# EAGLE design Lichtsteuerung-ESP8266 (EAGLE 6.6.0)
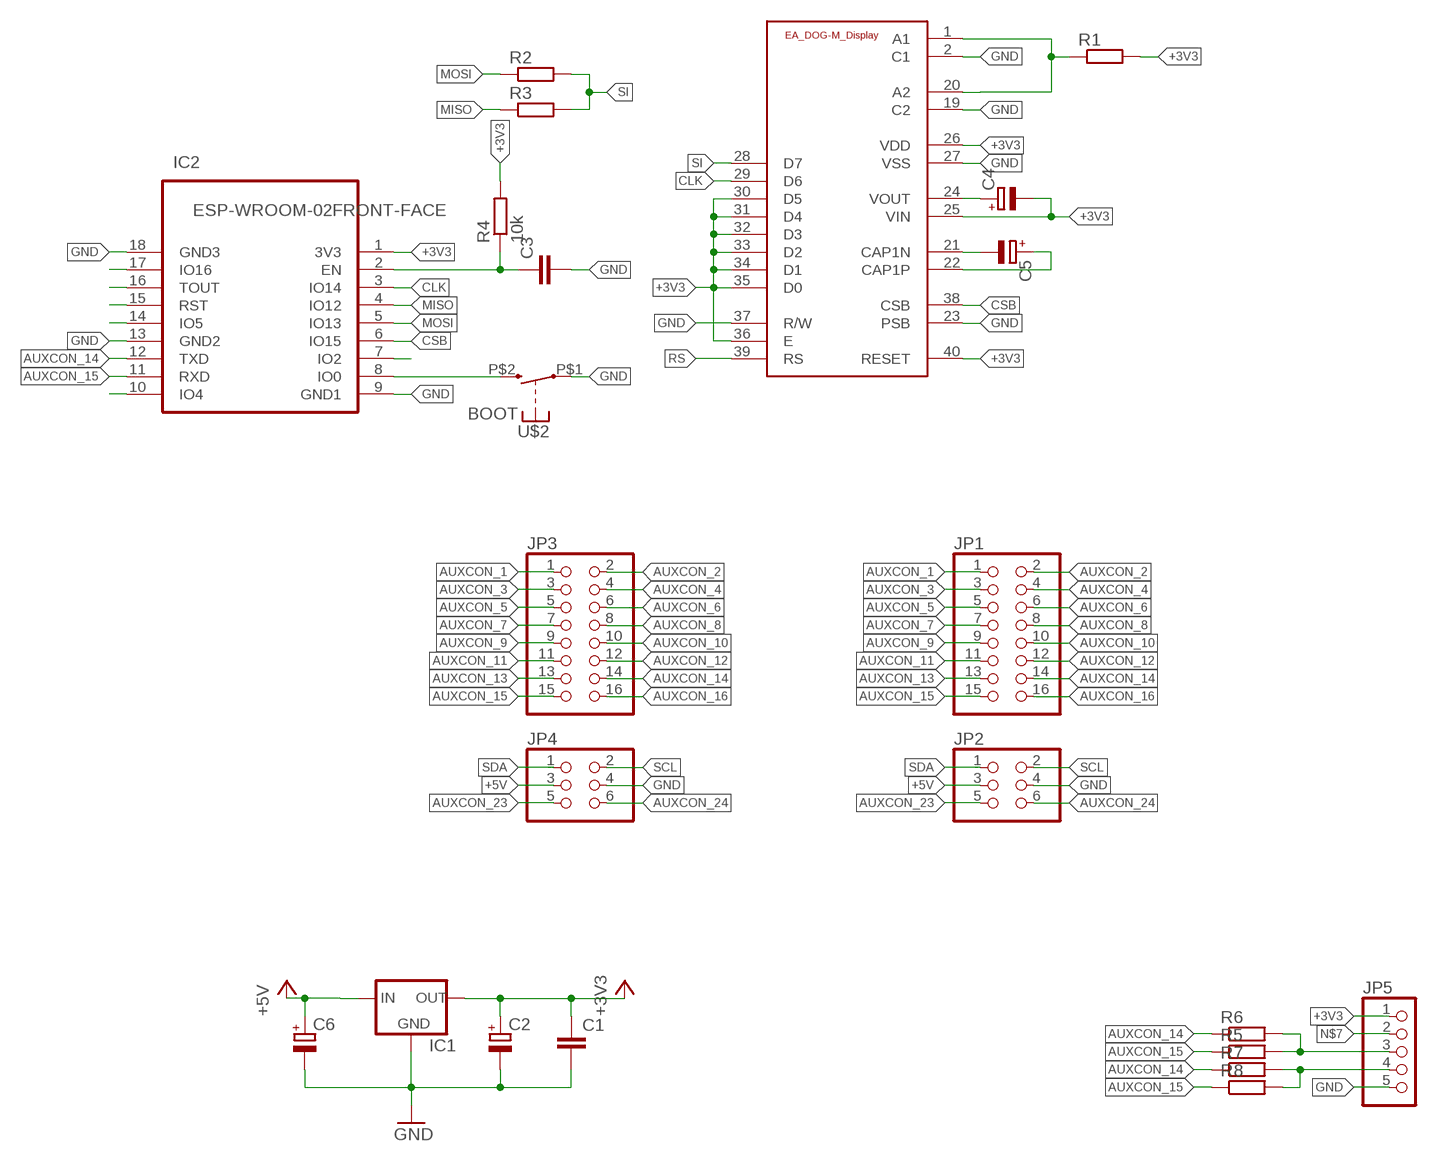
[diagram p0: schematic, sheet 1]

## Parts
C1  C-EUC1206  [C1206]
C2  CPOL-EUC/6032-28R  [C/6032-28R]
C3  C-EUC1206  [C1206]
C4  CPOL-EUSMCA  [SMC_A]
C5  CPOL-EUSMCA  [SMC_A]
C6  CPOL-EUC/6032-28R  [C/6032-28R]
IC1  LM1117  [SOT223]
IC2  ESP-WROOM-02FRONT-FACE  [FRONT-FACE]
JP1  PINHD-2X8  [2X08]
JP2  PINHD-2X3  [2X03]
JP3  PINHD-2X8  [2X08]
JP4  PINHD-2X3  [2X03]
JP5  PINHD-1X5  [1X05]
R1  R-EU_R1206  [R1206]
R2  R-EU_R1206  [R1206]
R3  R-EU_R1206  [R1206]
R4  10k  R-EU_R1206  [R1206]
R5  R-EU_R1206  [R1206]
R6  R-EU_R1206  [R1206]
R7  R-EU_R1206  [R1206]
R8  R-EU_R1206  [R1206]
U$1  EA_DOG-M_DISPLAY  [E_DOG-M_DISPLAY]
U$2  BOOT  ALPSSKPM  [SKPM]

## Nets
+3V3: C1.1 C2.+ C4.- IC1.2(OUT) IC2.1(3V3) JP5.1 R1.2 R4.2 U$1.25(VIN) U$1.26(VDD) U$1.30(D5) U$1.31(D4) U$1.32(D3) U$1.33(D2) U$1.34(D1) U$1.35(D0) U$1.36(E) U$1.40(RESET)
+5V: C6.+ IC1.3(IN) JP2.3 JP4.3
AUXCON_1: JP1.1 JP3.1
AUXCON_2: JP1.2 JP3.2
AUXCON_3: JP1.3 JP3.3
AUXCON_4: JP1.4 JP3.4
AUXCON_5: JP1.5 JP3.5
AUXCON_6: JP1.6 JP3.6
AUXCON_7: JP1.7 JP3.7
AUXCON_8: JP1.8 JP3.8
AUXCON_9: JP1.9 JP3.9
AUXCON_10: JP1.10 JP3.10
AUXCON_11: JP1.11 JP3.11
AUXCON_12: JP1.12 JP3.12
AUXCON_13: JP1.13 JP3.13
AUXCON_14: IC2.12(TXD) JP1.14 JP3.14 R6.1 R7.1
AUXCON_15: IC2.11(RXD) JP1.15 JP3.15 R5.1 R8.1
AUXCON_16: JP1.16 JP3.16
AUXCON_23: JP2.5 JP4.5
AUXCON_24: JP2.6 JP4.6
CLK: IC2.3(IO14) U$1.29(D6)
CSB: IC2.6(IO15) U$1.38(CSB)
GND: C1.2 C2.- C3.2 C6.- IC1.1(GND) IC2.9(GND1) IC2.13(GND2) IC2.18(GND3) JP2.4 JP4.4 JP5.5 U$1.2(C1) U$1.19(C2) U$1.23(PSB) U$1.27(VSS) U$1.37(R/W) U$2.P$1(P)
MISO: IC2.4(IO12) R3.1
MOSI: IC2.5(IO13) R2.1
N$2: C4.+ U$1.24(VOUT)
N$3: R1.1 U$1.1(A1) U$1.20(A2)
N$4: C5.- U$1.21(CAP1N)
N$5: C3.1 IC2.2(EN) R4.1
N$7: JP5.2
N$10: IC2.7(IO2)
N$11: IC2.8(IO0) U$2.P$2(S)
N$12: IC2.10(IO4)
N$13: C5.+ U$1.22(CAP1P)
N$15: IC2.14(IO5)
N$16: IC2.15(RST)
N$17: IC2.16(TOUT)
N$18: IC2.17(IO16)
N$111: JP5.3 R5.2 R6.2
N$222: JP5.4 R7.2 R8.2
RS: U$1.39(RS)
SCL: JP2.2 JP4.2
SDA: JP2.1 JP4.1
SI: R2.2 R3.2 U$1.28(D7)

## Library data of the parts
C1 C3 = rcl:C-EU: CAPACITOR, European symbol
C2 C4-C6 = rcl:CPOL-EU: POLARIZED CAPACITOR, European symbol
IC1 = v-reg-2:LM1117
IC2 = esp-wroom-02:ESP-WROOM-02: WiFi module - ESP-WROOM-02
JP1 JP3 = pinhead:PINHD-2X8: PIN HEADER; OC_REICHELT: MPE 087-2-016
JP2 JP4 = pinhead:PINHD-2X3: PIN HEADER; OC_REICHELT: MPE 087-2-006
JP5 = pinhead:PINHD-1X5: PIN HEADER
R1 = resistor:R-EU_: RESISTOR, European symbol
R2-R8 = rcl:R-EU_: RESISTOR, European symbol
U$1 = display_ea_dog-m:EA_DOG-M_DISPLAY
U$2 = ALPS SKPM:ALPSSKPM

## Board
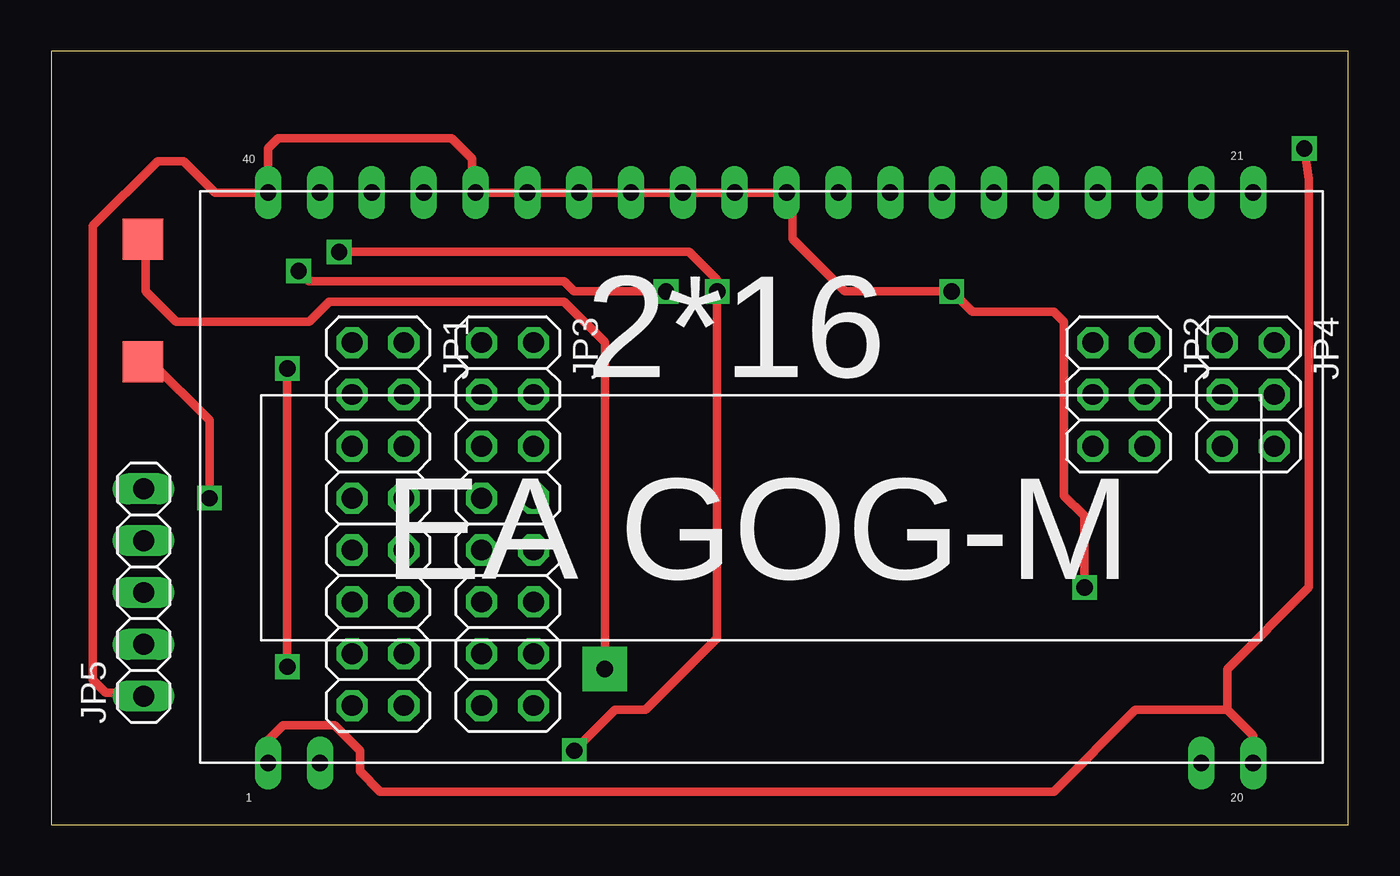
[diagram p1: board, top side]
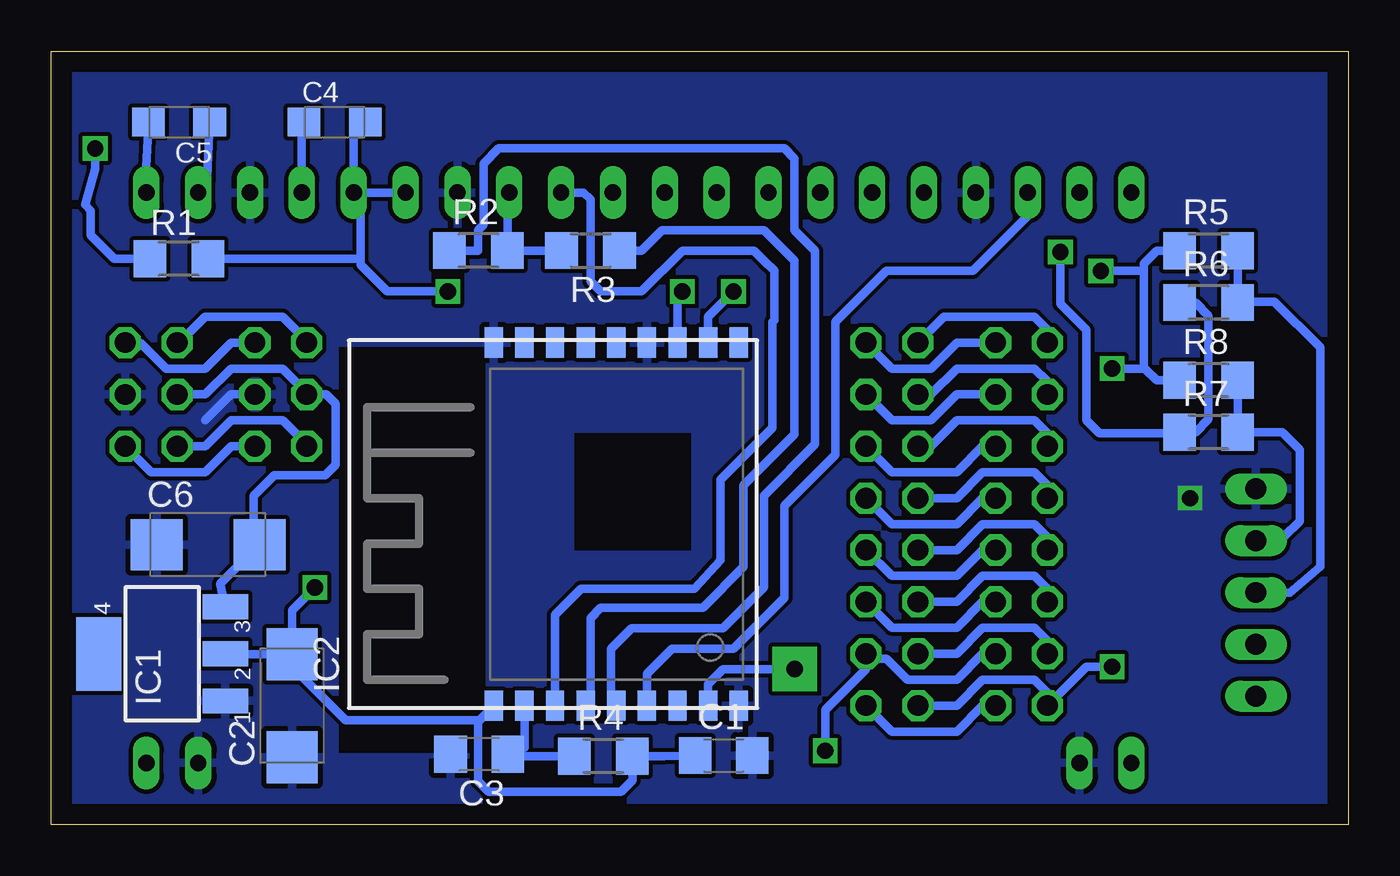
[diagram p2: board, bottom side, seen from below]

Size 63.57 x 37.91 mm. Coordinates in mm from the lower left corner, seen from the top.
Outline: 0,0 63.57,0 63.57,37.91 0,37.91 0,0
Copper layers (1*16): Top 0.035mm / dielectric 1.5mm / Bottom 0.035mm
Design rules "default": minimum track width 10mil, minimum drill 24mil, track to track 8mil, track to pad 8mil, pad to pad 8mil, via to via 8mil, smd to smd 8mil, copper to edge 40mil, drill to drill 8mil, minimum pad ring 10mil, minimum via ring 8mil, stop-mask expansion 4mil, vias tented up to drill 0mil, thermal gap 10mil

### Footprints (pad centres in the part's own frame; a part is rotated, then mirrored left to right if it is on the bottom)
C1206 = smd 1.6 x 1.8: 1 -1.4,0; 2 1.4,0
C/6032-28R = smd 2.55 x 2.5: + 2.525,0; - -2.525,0
SMC_A = smd 1.6 x 1.4: + -1.5,0; - 1.5,0
SOT223 = smd 1.219 x 2.235: 1 -2.311,-3.099; 2 0,-3.099; 3 2.311,-3.099 | smd 3.6 x 2.2: 4 0,3.099
FRONT-FACE = smd 1.485 x 0.9: 1 -8.893,4.9; 2 -8.893,3.4; 3 -8.893,1.9; 4 -8.893,0.4; 5 -8.893,-1.1; 6 -8.893,-2.6; 7 -8.893,-4.1; 8 -8.893,-5.6; 9 -8.893,-7.1; 10 8.893,-7.1; 11 8.893,-5.6; 12 8.893,-4.1; 13 8.893,-2.6; 14 8.893,-1.1; 15 8.893,0.4; 16 8.893,1.9; 17 8.893,3.4; 18 8.893,4.9
2X08 = drill 1.016 octagon: 1 -8.89,-1.27; 2 -8.89,1.27; 3 -6.35,-1.27; 4 -6.35,1.27; 5 -3.81,-1.27; 6 -3.81,1.27; 7 -1.27,-1.27; 8 -1.27,1.27; 9 1.27,-1.27; 10 1.27,1.27; 11 3.81,-1.27; 12 3.81,1.27; 13 6.35,-1.27; 14 6.35,1.27; 15 8.89,-1.27; 16 8.89,1.27
2X03 = drill 1.016 octagon: 1 -2.54,-1.27; 2 -2.54,1.27; 3 0,-1.27; 4 0,1.27; 5 2.54,-1.27; 6 2.54,1.27
1X05 = drill 1.016 long: 1 -5.08,0; 2 -2.54,0; 3 0,0; 4 2.54,0; 5 5.08,0
R1206 = smd 1.6 x 1.803: 1 -1.422,0; 2 1.422,0
E_DOG-M_DISPLAY = drill 0.8 long: 1 3.334,0; 2 5.874,0; 19 49.054,0; 20 51.594,0; 21 51.594,27.94; 22 49.054,27.94; 23 46.514,27.94; 24 43.974,27.94; 25 41.434,27.94; 26 38.894,27.94; 27 36.354,27.94; 28 33.814,27.94; 29 31.274,27.94; 30 28.734,27.94; 31 26.194,27.94; 32 23.654,27.94; 33 21.114,27.94; 34 18.574,27.94; 35 16.034,27.94; 36 13.494,27.94; 37 10.954,27.94; 38 8.414,27.94; 39 5.874,27.94; 40 3.334,27.94
SKPM = smd 2 x 2: P$1 -3,0; P$2 3,0

### Placement (x,y rotation side)
C1  30.61,3.4 0 bottom
C2  51.76,5.85 90 bottom
C3  42.59,3.46 180 bottom
C4  49.68,34.42 0 bottom
C5  57.3,34.42 180 bottom
C6  55.88,13.74 0 bottom
IC1  58.12,8.39 90 bottom
IC2  36.98,14.74 90 bottom
JP1  16.02,14.74 270 top
JP2  52.31,21.09 270 top
JP3  22.37,14.74 270 top
JP4  58.66,21.09 270 top
JP5  4.54,11.39 90 top
R1  57.31,27.74 0 bottom
R2  42.64,28.14 0 bottom
R3  37.14,28.14 180 bottom
R4  36.51,3.37 0 bottom
R5  6.86,28.13 0 bottom
R6  6.86,25.59 0 bottom
R7  6.86,19.24 0 bottom
R8  6.86,21.78 0 bottom
U$1  7.31,3.04 0 top
U$2  4.51,25.68 90 top

### Tracks (layer width: path | path; a pad name or v marks a point on that pad's centre or on a via)
+3V3  (via drill 0.8 pad 1.02)
  Top 0.406: v50.64,11.64 50.64,15.14 49.64,16.14 49.64,24.64 49.14,25.14 45.14,25.14 v44.14,26.14 38.91,26.14 36.34,28.71 36.34,30.67 U$1.30 U$1.31 U$1.32 U$1.33 U$1.34 U$1.35 U$1.36 20.64,31.14 20.64,32.64 19.64,33.64 11.14,33.64 10.64,33.14 U$1.40 8.04,30.98 6.5,32.52 5.23,32.52 2.05,29.34 2.05,7.12 2.69,6.48 4.36,6.48 JP5.1
  Bottom 0.406: U$1.26 U$1.25 | 42.07,5.65 IC2.1 42.58,5.14 | C2.+ 54.76,8.37 IC1.2 | R4.2 33.54,3.37 C1.1 | 35.14,2.82 R4.2 | C2.+ 51.76,7.76 49.14,5.14 42.58,5.14 | R4.2 35.09,2.18 35.64,1.64 42.14,1.64 42.64,2.14 42.64,5.08 42.58,5.14 | C2.+ 51.76,10.52 v50.64,11.64 | v44.14,26.14 46.53,26.14 47.11,26.14 48.41,27.43 48.41,27.64 | U$1.25 48.74,33.86 C4.- | 48.41,27.64 48.41,30.64 U$1.25 | R1.2 48.51,27.74 48.41,27.64
+5V
  Bottom 0.406: JP4.3 56.03,21.09 54.76,22.36 52.22,22.36 51.04,21.18 JP2.3 50.09,21.09 49.64,20.64 49.64,17.64 50.14,17.14 52.64,17.14 53.64,16.14 53.64,14.02 C6.+ 55.28,11.81 IC1.3
AUXCON_1
  Bottom 0.406: JP1.1 14.75,24.26 15.39,24.89 19.83,24.89 JP3.1
AUXCON_2
  Bottom 0.406: JP1.2 19.2,23.63 20.46,22.36 22.37,22.36 JP3.2
AUXCON_3
  Bottom 0.406: JP1.3 14.75,21.72 15.39,22.36 19.2,22.36 20.46,21.09 JP3.3
AUXCON_4
  Bottom 0.406: JP1.4 19.2,21.09 20.46,19.82 22.37,19.82 JP3.4
AUXCON_5
  Bottom 0.406: JP1.5 14.75,19.18 15.39,19.82 19.2,19.82 20.46,18.54 JP3.5
AUXCON_6
  Bottom 0.406: JP1.6 17.93,18.54 19.2,17.28 22.37,17.28 JP3.6
AUXCON_7
  Bottom 0.406: JP1.7 14.75,16.64 15.39,17.28 17.93,17.28 19.2,16 JP3.7
AUXCON_8
  Bottom 0.406: JP1.8 17.93,16 19.2,14.74 22.37,14.74 JP3.8
AUXCON_9
  Bottom 0.406: JP1.9 14.75,14.1 15.39,14.74 17.93,14.74 19.2,13.46 JP3.9
AUXCON_10
  Bottom 0.406: JP1.10 17.93,13.46 19.2,12.2 22.37,12.2 JP3.10
AUXCON_11
  Bottom 0.406: JP1.11 14.75,11.56 15.39,12.2 17.93,12.2 19.2,10.93 JP3.11
AUXCON_12
  Bottom 0.406: JP1.12 17.93,10.93 19.2,9.66 22.37,9.66 JP3.12
AUXCON_13
  Bottom 0.406: JP1.13 14.75,9.02 15.39,9.66 17.93,9.66 19.2,8.39 JP3.13
AUXCON_14  (via drill 0.8 pad 1.02)
  Top 0.406: v25.64,3.64 27.64,5.64 29.14,5.64 32.64,9.14 v32.64,26.14 32.64,26.7 31.26,28.07 v14.12,28.07
  Bottom 0.406: JP1.14 17.93,8.39 19.2,7.12 21.61,7.12 22.64,8.14 23.39,8.14 JP3.14 23.64,7.64 25.64,5.64 v25.64,3.64 | R6.1 7.49,25.59 6.86,24.95 6.86,19.87 7.49,19.24 R7.1 8.33,19.18 12.21,19.18 12.85,19.82 12.85,24.26 14.12,25.53 v14.12,28.07 | IC2.12 32.88,25.89 v32.64,26.14
AUXCON_15  (via drill 0.8 pad 1.02)
  Top 0.406: v30.14,26.14 25.64,26.14 25.14,26.64 12.64,26.64 v12.14,27.14 | v11.58,7.75 v11.58,22.36
  Bottom 0.406: JP1.15 14.75,6.48 15.39,7.12 17.93,7.12 19.2,5.85 JP3.15 21.35,5.85 | R8.1 9.4,21.78 9.95,22.32 10.03,22.41 | 10.03,22.41 10.03,25.15 10.03,27.14 | 10.03,27.14 10.03,27.49 9.4,28.13 R5.1 | JP1.15 14.43,5.85 | IC2.11 31.38,24.89 v30.14,26.14 | v12.14,27.14 10.03,27.14 | JP1.15 12.85,7.75 v11.58,7.75 | v11.58,22.36 10.09,22.36 10.03,22.41
AUXCON_16
  Bottom 0.406: JP1.16 17.93,5.85 19.2,4.58 22.37,4.58 JP3.16
AUXCON_23
  Bottom 0.406: JP2.5 51.04,18.64 52.22,19.82 54.76,19.82 56.03,18.54 JP4.5
AUXCON_24
  Bottom 0.406: JP2.6 54.76,18.54 56.03,17.28 58.66,17.28 JP4.6
CLK
  Bottom 0.406: IC2.3 38.88,10.29 37.61,11.56 32.03,11.56 30.76,12.96 30.76,16.91 28.22,19.45 28.22,24.39 28.22,24.64 28.14,24.72 28.14,27.14 28.64,27.64 29.14,28.14 32.64,28.14 34.64,26.14 36.64,26.14 37.14,26.64 37.14,30.64 37.48,30.98 U$1.29
CSB
  Bottom 0.406: IC2.6 34.38,7.4 33.14,8.64 30.14,8.64 27.64,11.14 27.64,15.64 25.14,18.14 25.14,24.64 22.64,27.14 18.41,27.14 15.64,29.91 15.64,30.89 U$1.38
GND  (via drill 0.8 pad 1.02)
  Top 0.406: U$2.P$1 4.9,22.68 7.77,19.82 v7.77,16
  Bottom 0.406: JP2.4 54.76,21.09 56.03,19.82
  pour Bottom: -3.96,37.33 42.06,37.59 42.06,-3.04 -2.96,-3.04
  pour Bottom: 40.78,-3.04 40.78,3.31 49.68,3.31 49.68,23.63 42.06,23.63 42.06,37.59 75.08,37.59 75.08,-1.77 42.06,-1.77 42.06,-3.04
MISO
  Bottom 0.406: IC2.4 37.14,6.08 37.14,10.14 36.64,10.64 31.64,10.64 29.64,12.64 29.64,16.64 27.14,19.14 27.14,25.64 27.14,27.64 28.64,29.14 33.64,29.14 34.64,28.14 R3.1
MOSI
  Bottom 0.406: R2.1 42.64,28.14 42.64,29.14 42.39,29.39 42.39,32.39 41.64,33.14 32.64,33.14 27.64,33.14 27.14,32.64 27.14,29.14 26.14,28.14 26.14,18.64 28.64,16.14 28.64,11.64 30.64,9.64 32.14,9.64 35.14,9.64 36.14,8.64 36.14,6.1 IC2.5
N$2
  Bottom 0.406: 51.04,30.74 U$1.24 51.28,34.32 C4.+
N$3  (via drill 0.8 pad 1.02)
  Top 0.406: U$1.20 58.9,4.37 57.64,5.64 | 57.64,5.64 53.14,5.64 49.14,1.64 16.14,1.64 15.14,2.64 15.14,3.64 13.89,4.89 11.39,4.89 10.64,4.14 U$1.1 | 57.64,5.64 57.64,7.64 61.64,11.64 61.64,31.64 v61.41,33.14
  Bottom 0.406: v61.41,33.14 61.41,32.14 61.91,30.36 61.64,30.1 61.64,28.89 60.48,27.74 R1.1
N$4
  Bottom 0.406: C5.- 58.97,30.91 U$1.21
N$5
  Bottom 0.406: IC2.2 40.38,3.81 40.38,3.78 C3.1 41.09,3.37 R4.1
N$11  (via drill 0.8 pad 2.18)
  Top 0.406: v27.14,7.64 27.14,23.64 25.14,25.64 13.64,25.64 12.64,24.64 6.14,24.64 4.64,26.14 4.64,28.56 U$2.P$2
  Bottom 0.406: IC2.8 31.38,6.9 30.64,7.64 v27.14,7.64
N$13
  Bottom 0.406: C5.+ 55.97,30.59 U$1.22
N$111
  Bottom 0.406: R5.2 R6.2 5.38,25.64 3.64,25.64 1.39,23.39 1.39,12.64 2.89,11.39 JP5.3
N$222
  Bottom 0.406: R8.2 R7.2 3.24,19.24 2.39,18.39 2.39,14.89 3.14,14.14 4.33,14.14 JP5.4
SCL
  Bottom 0.406: JP2.2 54.76,23.63 56.03,22.36 57.93,22.36 59.2,23.63 JP4.2
SDA
  Bottom 0.406: JP2.1 51.04,23.72 52.22,24.89 56.03,24.89 57.3,23.63 57.3,23.72 JP4.1
SI
  Bottom 0.406: 41.21,30.88 U$1.28 41.21,30.88 | R3.2 R2.2 41.21,30.88